# EAGLE schematic LB_BIT_1IN_2OUT-XXXL-v03(1_1x) (EAGLE 6.6.0)
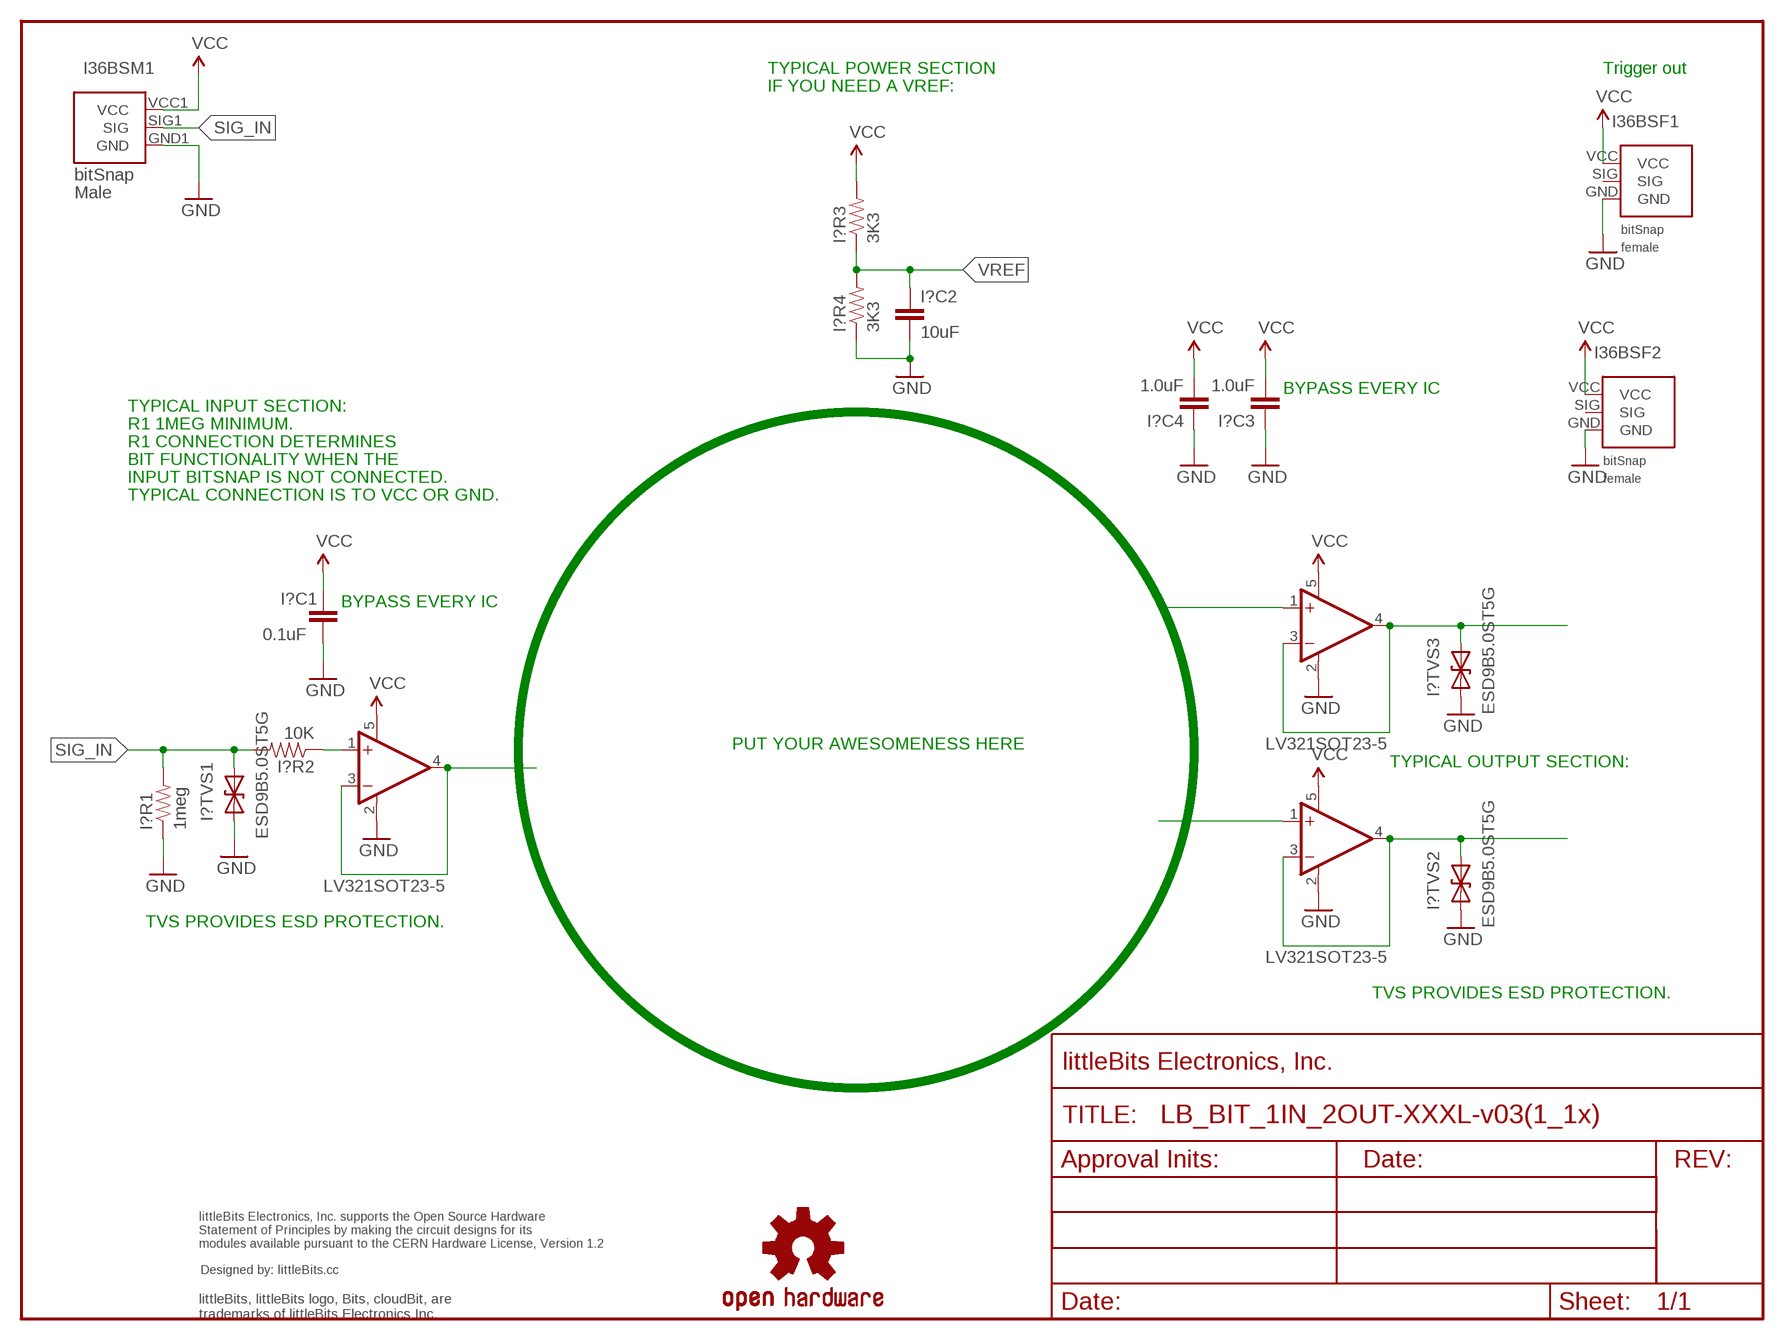
[diagram p0: schematic, sheet 1]

## Parts
FRAME1  FRAME-LETTER  [FABDWG01-OHW]
I36BSF1  BITSNAP_V03_FEMALE  [BITSNAP_V03_FEMALE]
I36BSF2  BITSNAP_V03_FEMALE  [BITSNAP_V03_FEMALE]
I36BSM1  BITSNAP_V03_MALE  [BITSNAP_V03_MALE]
I?C1  0.1uF  CAPCAP-0603  [CAP-0603]
I?C2  10uF  CAPCAP-0603  [CAP-0603]
I?C3  1.0uF  CAPCAP-0603  [CAP-0603]
I?C4  1.0uF  CAPCAP-0603  [CAP-0603]
I?R1  1meg  RESISTOR0603  [RES-0603]
I?R2  10K  RESISTOR0603  [RES-0603]
I?R3  3K3  RESISTOR0603  [RES-0603]
I?R4  3K3  RESISTOR0603  [RES-0603]
I?TVS1  ESD9B5.0ST5G  DIODE-TVSSOD-923  [SOD-923]
I?TVS2  ESD9B5.0ST5G  DIODE-TVSSOD-923  [SOD-923]
I?TVS3  ESD9B5.0ST5G  DIODE-TVSSOD-923  [SOD-923]
U1  LV321SOT23-5  [SOT23-5]
U2  LV321SOT23-5  [SOT23-5]
U3  LV321SOT23-5  [SOT23-5]
U$1  OSHW-LOGOL  [OSHW-LOGO-L]
U$3  OSHWCREDIT  [OSHWCREDIT]

## Nets
GND: I36BSF1.GND I36BSF2.GND I36BSM1.GND1(GND) I?C1.2 I?C2.2 I?C3.1 I?C4.1 I?R1.1 I?R4.1 I?TVS1.1(A) I?TVS2.1(A) I?TVS3.1(A) U1.2(V-) U2.2(V-) U3.2(V-)
N$1: U3.1(+IN)
N$2: U1.3(-IN) U1.4(OUT)
N$3: U2.1(+IN)
N$4: I?R2.1 U1.1(+IN)
SIG_IN: I36BSM1.SIG1(SIG) I?R1.2 I?R2.2 I?TVS1.2(C)
SIG_OUT: I?TVS2.2(C) U2.3(-IN) U2.4(OUT)
SIG_OUT1: I?TVS3.2(C) U3.3(-IN) U3.4(OUT)
VCC: I36BSF1.VCC I36BSF2.VCC I36BSM1.VCC1(VCC) I?C1.1 I?C3.2 I?C4.2 I?R3.2 U1.5(V+) U2.5(V+) U3.5(V+)
VREF: I?C2.1 I?R3.1 I?R4.2
Unconnected: I36BSF1.SIG I36BSF2.SIG

## Notes on the sheet
- TYPICAL POWER SECTION | Trigger out
- IF YOU NEED A VREF:
- BYPASS EVERY IC
- TYPICAL INPUT SECTION:
- R1 1MEG MINIMUM.
- R1 CONNECTION DETERMINES
- BIT FUNCTIONALITY WHEN THE
- INPUT BITSNAP IS NOT CONNECTED.
- TYPICAL CONNECTION IS TO VCC OR GND.
- BYPASS EVERY IC
- PUT YOUR AWESOMENESS HERE
- TYPICAL OUTPUT SECTION:
- TVS PROVIDES ESD PROTECTION.
- TVS PROVIDES ESD PROTECTION.

## Library data of the parts
FRAME1 = LITTLEBITS:FRAME-LETTER
I36BSF1 I36BSF2 = bitSnap:BITSNAP_V03_FEMALE
I36BSM1 = bitSnap:BITSNAP_V03_MALE
I?C1-I?C4 = LITTLEBITS:CAP
I?R1-I?R4 = LITTLEBITS:RESISTOR
I?TVS1-I?TVS3 = LITTLEBITS:DIODE-TVS: Bidirectional Transient Voltage Suppression Diode: Device conducts in avalanche mode after reaching a part dependent voltage threshold. Used for limiting voltage spikes on ESD sensitive inputs and outputs.; IEC_ESD_PROT0: +/-18kV; LB_PN: ?; MPN: ESD9B5.0ST5G; V_CLAMP: ?; V_OPERATION: 5V
U1-U3 = LITTLEBITS:LV321
U$1 = LITTLEBITS131206:OSHW-LOGO: Open Source Hardware Logo This logo indicates the piece of hardware it is found on incorporates a OSHW license and/or adheres to the definition of open source hardware found here: http://freedomdefined.org/OSHW
U$3 = LITTLEBITS:OSHWCREDIT